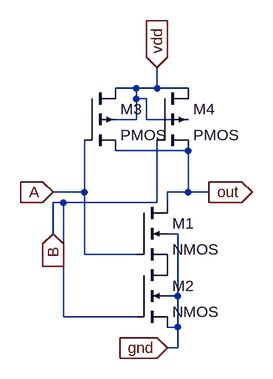
[diagram p0: schematic nand.asc]
nand.asc, the LTspice schematic file:
Version 4.1
SHEET 1 880 680
WIRE 176 -48 144 -48
WIRE 208 -48 208 -80
WIRE 208 -48 176 -48
WIRE 256 -48 208 -48
WIRE 176 -32 176 -48
WIRE 192 -32 176 -32
WIRE 176 0 176 -32
WIRE 176 0 144 0
WIRE 192 0 192 -32
WIRE 256 0 192 0
WIRE 256 48 144 48
WIRE 96 112 96 32
WIRE 96 112 48 112
WIRE 256 112 256 48
WIRE 256 112 224 112
WIRE 288 112 256 112
WIRE 64 128 48 128
WIRE 208 128 208 32
WIRE 208 128 64 128
WIRE 224 128 224 112
WIRE 48 176 48 128
WIRE 240 176 224 176
WIRE 96 208 96 112
WIRE 176 208 96 208
WIRE 240 272 240 176
WIRE 240 272 224 272
WIRE 64 304 64 128
WIRE 176 304 64 304
WIRE 240 320 240 272
WIRE 240 320 224 320
WIRE 240 352 240 320
WIRE 240 352 224 352
FLAG 208 -80 vdd
IOPIN 208 -80 In
FLAG 48 112 A
IOPIN 48 112 In
FLAG 224 352 gnd
IOPIN 224 352 In
FLAG 48 176 B
IOPIN 48 176 In
FLAG 288 112 out
IOPIN 288 112 Out
SYMBOL nmos4 176 128 R0
SYMATTR InstName M1
SYMBOL nmos4 176 224 R0
SYMATTR InstName M2
SYMBOL pmos4 96 -48 R0
SYMATTR InstName M3
SYMBOL pmos4 208 -48 R0
SYMATTR InstName M4

The netlist it stands for:
* nand.asc
M1 out A P001 gnd NMOS
M2 P001 B gnd gnd NMOS
M3 vdd A out vdd PMOS
M4 vdd B out vdd PMOS
.model NMOS NMOS
.model PMOS PMOS
.lib standard.mos
.backanno
.end